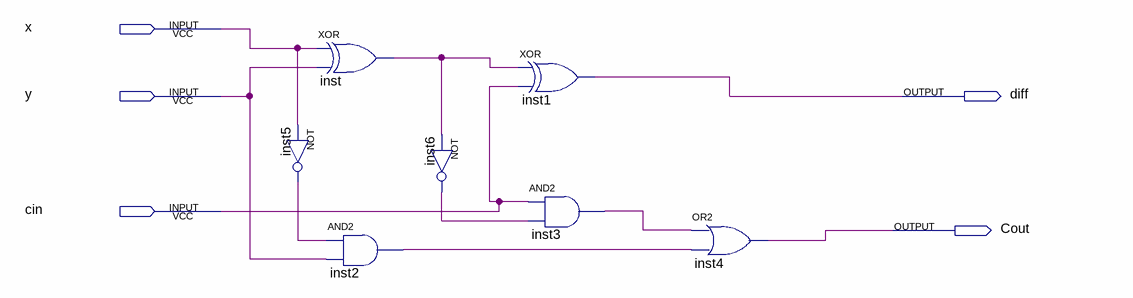
[diagram p0: schematic sheet]
// Quartus schematic subtractor.bdf as structural Verilog: 7 symbols, 5 pins
module subtractor (
  input  x,
  input  y,
  input  cin,
  output diff,
  output Cout
);

  wire inst2_out, inst3_out, inst5_out, inst6_out, inst_out;

  xor inst (inst_out, x, y);
  not inst5 (inst5_out, x);
  and inst2 (inst2_out, inst5_out, y);
  not inst6 (inst6_out, inst_out);
  xor inst1 (diff, inst_out, cin);
  and inst3 (inst3_out, cin, inst6_out);
  or inst4 (Cout, inst3_out, inst2_out);
endmodule
